# Altium schematic sheet adc filter.SchDoc
size A4
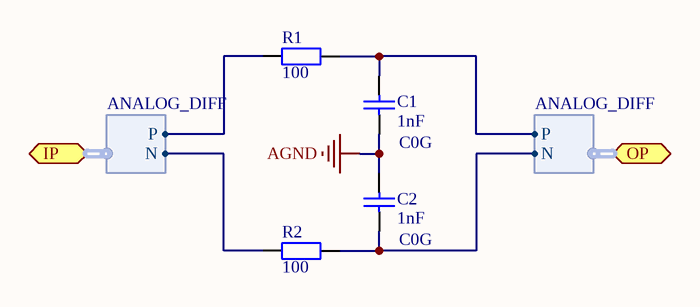
[diagram p0: adc filter.SchDoc]

## Parts
C1  value 1nF  Type: C0G  [C0603]  (hidden comment: Cap)
C2  value 1nF  Type: C0G  [C0603]  (hidden comment: Cap)
R1  value 100  [R0603]  (hidden comment: Res2)
R2  value 100  [R0603]  (hidden comment: Res2)

## Ports
IP (harness ANALOG_DIFF), OP (harness ANALOG_DIFF)

## Harnesses
ANALOG_DIFF: P, N

## Nets
AGND: C1.1 C2.2
NetC1_2: C1.2 R1.2 ; port OP.P
NetC2_1: C2.1 R2.2 ; port OP.N
NetR1_1: R1.1 ; port IP.P
NetR2_1: R2.1 ; port IP.N

## Library data of the parts
C1 C2 = Cap: Capacitor; Published: 8-Jun-2000; LatestRevisionDate: 17-Jul-2002; LatestRevisionNote: Re-released for DXP Platform.; PackageReference: RAD-0.3; Publisher: Altium Limited; farnell: 2070394
R1 R2 = Res2: Resistor; Published: 8-Jun-2000; LatestRevisionDate: 17-Jul-2002; LatestRevisionNote: Re-released for DXP Platform.; PackageReference: AXIAL-0.4; Publisher: Altium Limited; farnell: 9330364
  R1: farnell: 2074273